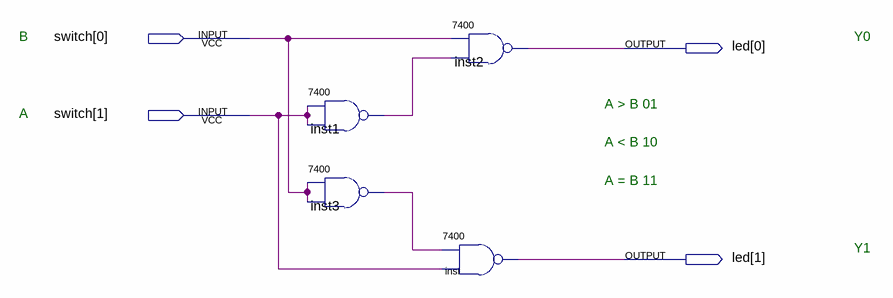
[diagram p0: schematic sheet]
// Quartus schematic pj302.bdf as structural Verilog: 4 symbols, 4 pins
module pj302 (
  input  [1:0] switch,
  output [1:0] led
);

  wire inst1_1, inst3_1;

  \7400  inst1 (.\3 (switch[1]), .\2 (switch[1]), .\1 (inst1_1));
  \7400  inst3 (.\3 (switch[0]), .\2 (switch[0]), .\1 (inst3_1));
  \7400  inst2 (.\3 (inst1_1), .\2 (switch[0]), .\1 (led[0]));
  \7400  inst (.\3 (switch[1]), .\2 (inst3_1), .\1 (led[1]));

  // Notes on the sheet:
  //   B
  //   Y0
  //   A > B 01
  //   A
  //   A < B 10
  //   A = B 11
  //   Y1
endmodule
